# Altium schematic sheet INT_CONN.SchDoc
size A3; ApprovedBy: D. Grossman; CheckedBy: G. Engel; Author: Y. Yakov; CompanyName: LightSense; DrawnBy: Y. Yakov; Engineer: Y.Yakov; Organization: LightSense
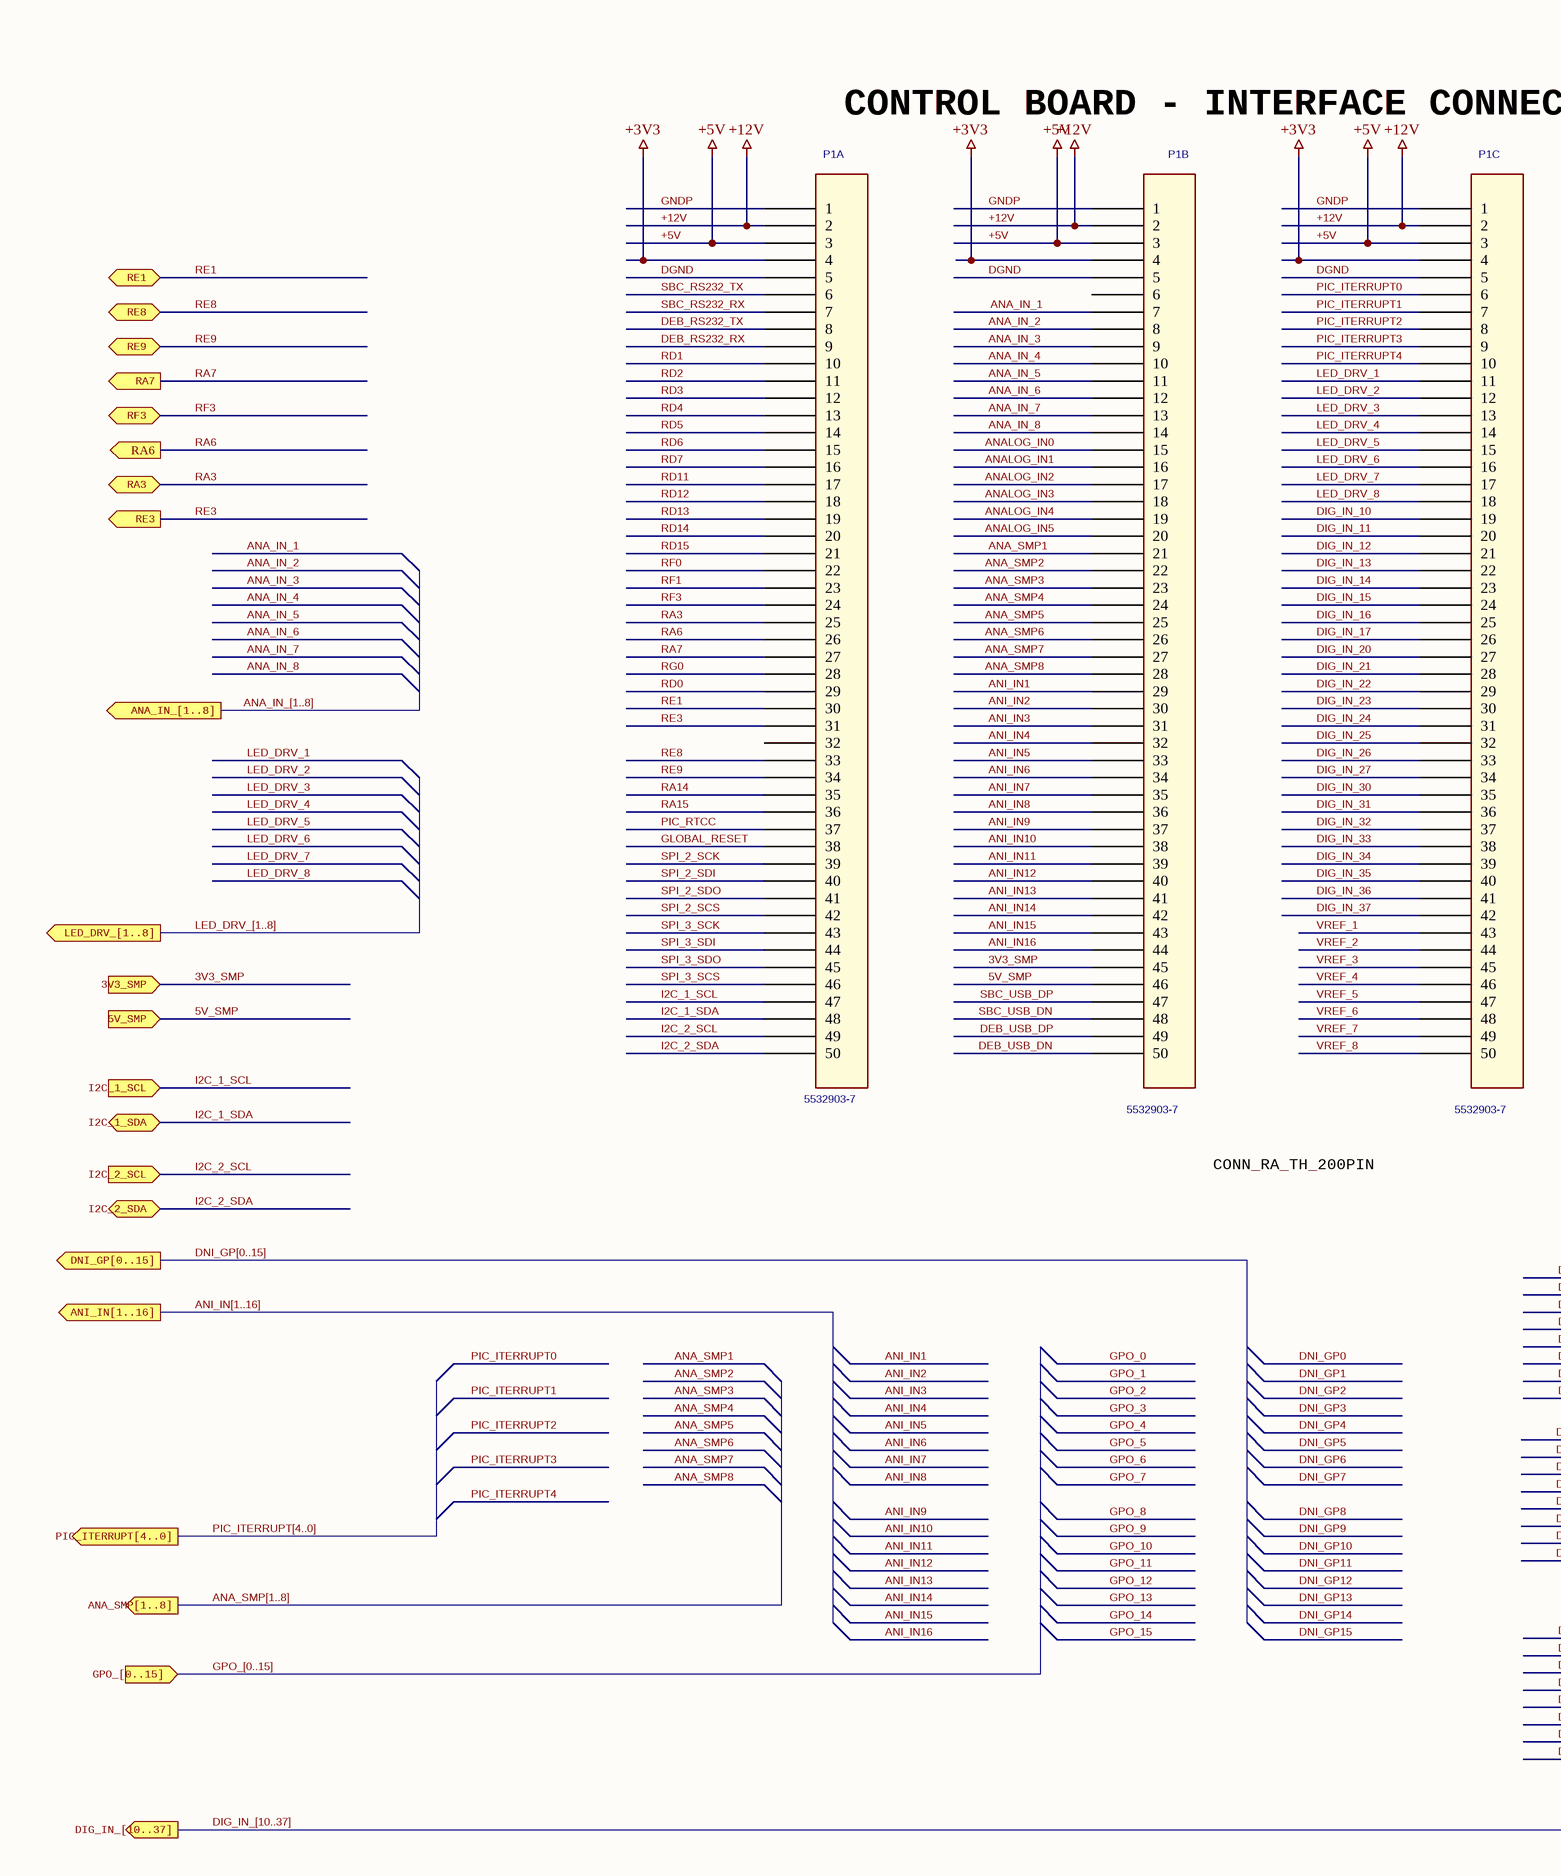
[diagram p0: INT_CONN.SchDoc, left]
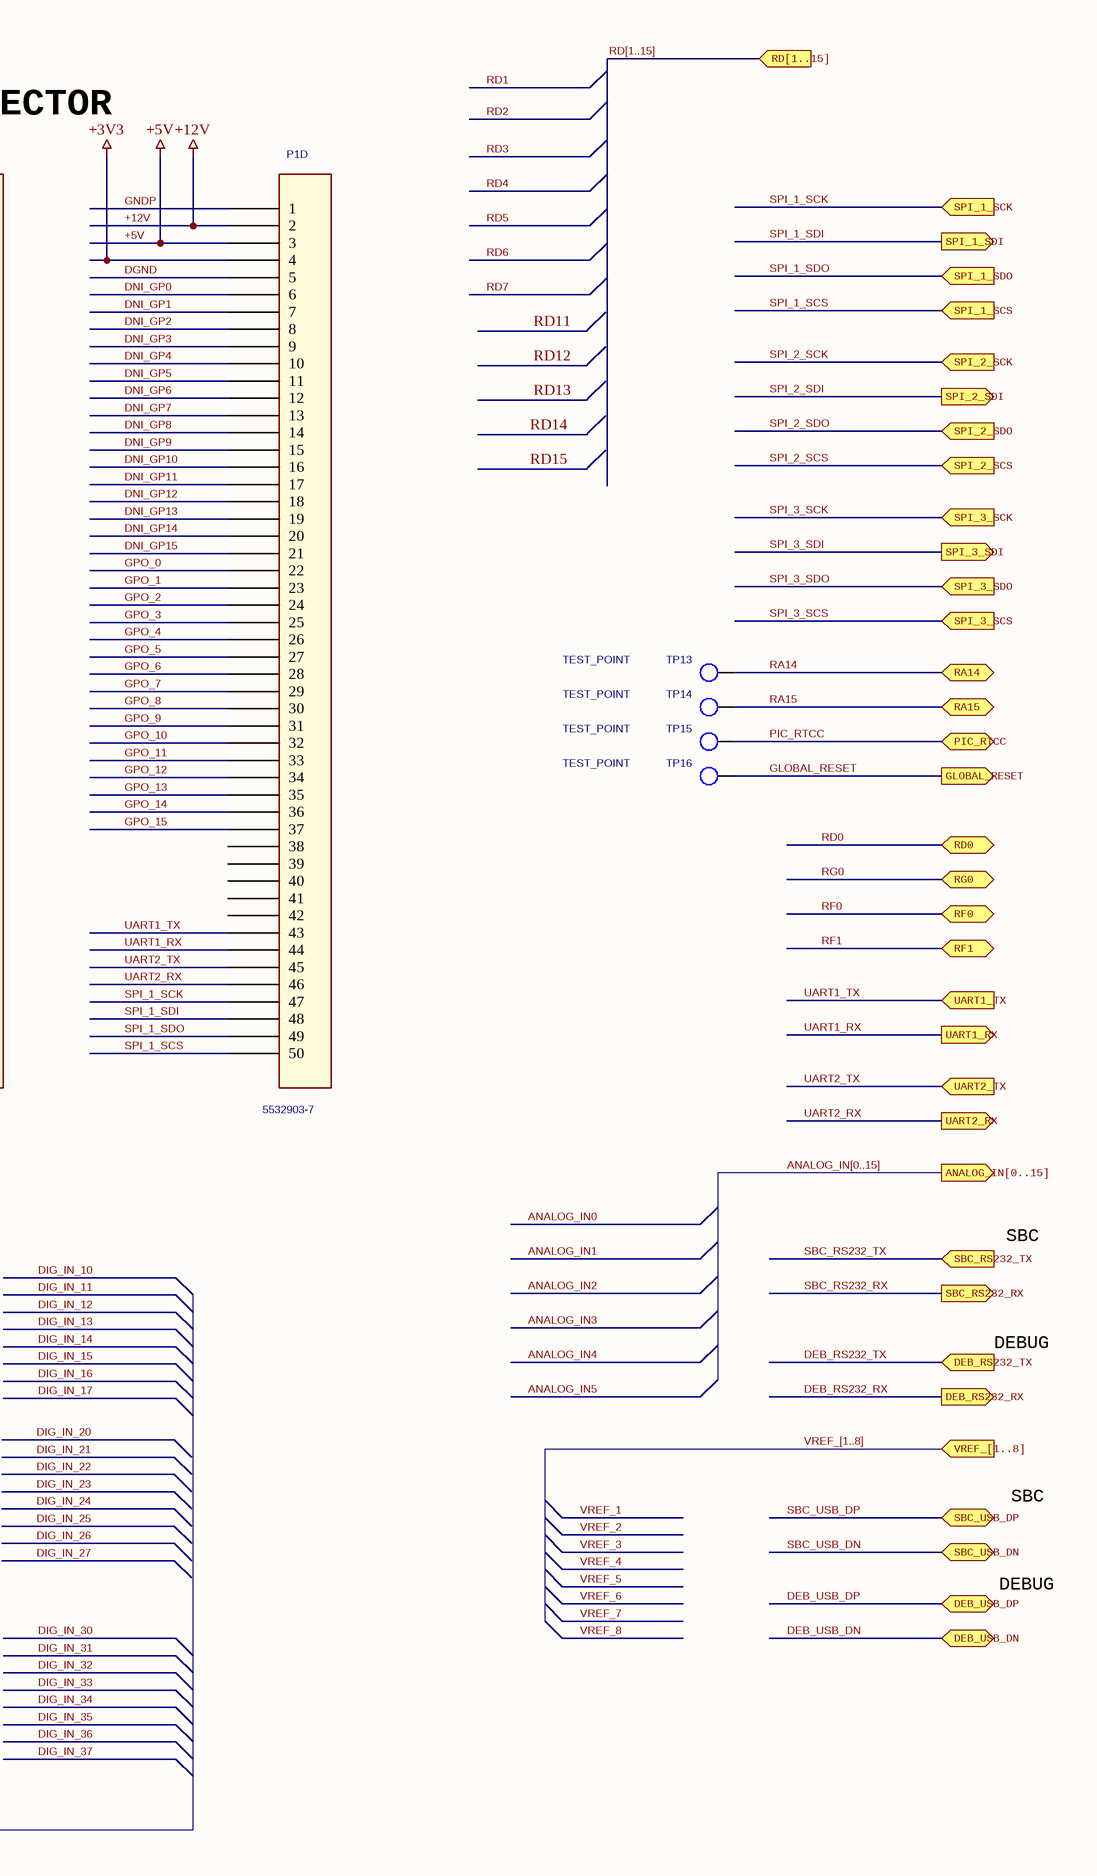
[diagram p1: INT_CONN.SchDoc, right]

## Parts
P1  5532903-7  [TH_4X50_100mil]  (parts A,B,C,D of 4)
TP13  TEST_POINT  [TH_1mm]
TP14  TEST_POINT  [TH_1mm]
TP15  TEST_POINT  [TH_1mm]
TP16  TEST_POINT  [TH_1mm]

## Ports
3V3_SMP (in), 5V_SMP (in), ANA_IN_[1..8] (out), ANA_SMP[1..8] (out), ANALOG_IN[0..15] (out), ANI_IN[1..16] (out), DEB_RS232_RX (out), DEB_RS232_TX (in), DEB_USB_DN (bidir), DEB_USB_DP (bidir), DIG_IN_[10..37] (out), DNI_GP[0..15] (out), GLOBAL_RESET (out), GPO_[0..15] (in), I2C_1_SCL (in), I2C_1_SDA (bidir), I2C_2_SCL (in), I2C_2_SDA (bidir), LED_DRV_[1..8] (out), PIC_ITERRUPT[4..0] (out), PIC_RTCC (bidir), RA3 (bidir), RA6 (out), RA7 (out), RA14 (bidir), RA15 (bidir), RD0 (bidir), RD[1..15] (in), RE1 (bidir), RE3 (out), RE8 (bidir), RE9 (bidir), RF0 (bidir), RF1 (bidir), RF3 (bidir), RG0 (bidir), SBC_RS232_RX (out), SBC_RS232_TX (in), SBC_USB_DN (bidir), SBC_USB_DP (bidir), SPI_1_SCK (in), SPI_1_SCS (in), SPI_1_SDI (out), SPI_1_SDO (in), SPI_2_SCK (in), SPI_2_SCS (in), SPI_2_SDI (out), SPI_2_SDO (in), SPI_3_SCK (in), SPI_3_SCS (in), SPI_3_SDI (out), SPI_3_SDO (in), UART1_RX (out), UART1_TX (in), UART2_RX (out), UART2_TX (in), VREF_[1..8] (in)

## Nets
+3V3: P1.4A(4) P1.4B(4) P1.4C(4) P1.4D(4)
+5V: P1.3A(3) P1.3B(3) P1.3C(3) P1.3D(3)
+12V: P1.2A(2) P1.2B(2) P1.2C(2) P1.2D(2)
3V3_SMP: P1.45B(45) ; port 3V3_SMP
5V_SMP: P1.46B(46) ; port 5V_SMP
ANA_IN_1: P1.7B(7)
ANA_IN_2: P1.8B(8)
ANA_IN_3: P1.9B(9)
ANA_IN_4: P1.10B(10)
ANA_IN_5: P1.11B(11)
ANA_IN_6: P1.12B(12)
ANA_IN_7: P1.13B(13)
ANA_IN_8: P1.14B(14)
ANA_SMP1: P1.21B(21)
ANA_SMP2: P1.22B(22)
ANA_SMP3: P1.23B(23)
ANA_SMP4: P1.24B(24)
ANA_SMP5: P1.25B(25)
ANA_SMP6: P1.26B(26)
ANA_SMP7: P1.27B(27)
ANA_SMP8: P1.28B(28)
ANALOG_IN0: P1.15B(15)
ANALOG_IN1: P1.16B(16)
ANALOG_IN2: P1.17B(17)
ANALOG_IN3: P1.18B(18)
ANALOG_IN4: P1.19B(19)
ANALOG_IN5: P1.20B(20)
ANI_IN1: P1.29B(29)
ANI_IN2: P1.30B(30)
ANI_IN3: P1.31B(31)
ANI_IN4: P1.32B(32)
ANI_IN5: P1.33B(33)
ANI_IN6: P1.34B(34)
ANI_IN7: P1.35B(35)
ANI_IN8: P1.36B(36)
ANI_IN9: P1.37B(37)
ANI_IN10: P1.38B(38)
ANI_IN11: P1.39B(39)
ANI_IN12: P1.40B(40)
ANI_IN13: P1.41B(41)
ANI_IN14: P1.42B(42)
ANI_IN15: P1.43B(43)
ANI_IN16: P1.44B(44)
DEB_RS232_RX: P1.9A(9) ; port DEB_RS232_RX
DEB_RS232_TX: P1.8A(8) ; port DEB_RS232_TX
DEB_USB_DN: P1.50B(50) ; port DEB_USB_DN
DEB_USB_DP: P1.49B(49) ; port DEB_USB_DP
DGND: P1.5A(5) P1.5B(5) P1.5C(5) P1.5D(5)
DIG_IN_10: P1.19C(19)
DIG_IN_11: P1.20C(20)
DIG_IN_12: P1.21C(21)
DIG_IN_13: P1.22C(22)
DIG_IN_14: P1.23C(23)
DIG_IN_15: P1.24C(24)
DIG_IN_16: P1.25C(25)
DIG_IN_17: P1.26C(26)
DIG_IN_20: P1.27C(27)
DIG_IN_21: P1.28C(28)
DIG_IN_22: P1.29C(29)
DIG_IN_23: P1.30C(30)
DIG_IN_24: P1.31C(31)
DIG_IN_25: P1.32C(32)
DIG_IN_26: P1.33C(33)
DIG_IN_27: P1.34C(34)
DIG_IN_30: P1.35C(35)
DIG_IN_31: P1.36C(36)
DIG_IN_32: P1.37C(37)
DIG_IN_33: P1.38C(38)
DIG_IN_34: P1.39C(39)
DIG_IN_35: P1.40C(40)
DIG_IN_36: P1.41C(41)
DIG_IN_37: P1.42C(42)
DNI_GP0: P1.6D(6)
DNI_GP1: P1.7D(7)
DNI_GP2: P1.8D(8)
DNI_GP3: P1.9D(9)
DNI_GP4: P1.10D(10)
DNI_GP5: P1.11D(11)
DNI_GP6: P1.12D(12)
DNI_GP7: P1.13D(13)
DNI_GP8: P1.14D(14)
DNI_GP9: P1.15D(15)
DNI_GP10: P1.16D(16)
DNI_GP11: P1.17D(17)
DNI_GP12: P1.18D(18)
DNI_GP13: P1.19D(19)
DNI_GP14: P1.20D(20)
DNI_GP15: P1.21D(21)
GLOBAL_RESET: P1.38A(38) TP16.1(TP) ; port GLOBAL_RESET
GNDP: P1.1A(1) P1.1B(1) P1.1C(1) P1.1D(1)
GPO_0: P1.22D(22)
GPO_1: P1.23D(23)
GPO_2: P1.24D(24)
GPO_3: P1.25D(25)
GPO_4: P1.26D(26)
GPO_5: P1.27D(27)
GPO_6: P1.28D(28)
GPO_7: P1.29D(29)
GPO_8: P1.30D(30)
GPO_9: P1.31D(31)
GPO_10: P1.32D(32)
GPO_11: P1.33D(33)
GPO_12: P1.34D(34)
GPO_13: P1.35D(35)
GPO_14: P1.36D(36)
GPO_15: P1.37D(37)
I2C_1_SCL: P1.47A(47) ; port I2C_1_SCL
I2C_1_SDA: P1.48A(48) ; port I2C_1_SDA
I2C_2_SCL: P1.49A(49) ; port I2C_2_SCL
I2C_2_SDA: P1.50A(50) ; port I2C_2_SDA
LED_DRV_1: P1.11C(11)
LED_DRV_2: P1.12C(12)
LED_DRV_3: P1.13C(13)
LED_DRV_4: P1.14C(14)
LED_DRV_5: P1.15C(15)
LED_DRV_6: P1.16C(16)
LED_DRV_7: P1.17C(17)
LED_DRV_8: P1.18C(18)
PIC_ITERRUPT0: P1.6C(6)
PIC_ITERRUPT1: P1.7C(7)
PIC_ITERRUPT2: P1.8C(8)
PIC_ITERRUPT3: P1.9C(9)
PIC_ITERRUPT4: P1.10C(10)
PIC_RTCC: P1.37A(37) TP15.1(TP) ; port PIC_RTCC
RA3: P1.25A(25) ; port RA3
RA6: P1.26A(26) ; port RA6
RA7: P1.27A(27) ; port RA7
RA14: P1.35A(35) TP13.1(TP) ; port RA14
RA15: P1.36A(36) TP14.1(TP) ; port RA15
RD0: P1.29A(29) ; port RD0
RD1: P1.10A(10)
RD2: P1.11A(11)
RD3: P1.12A(12)
RD4: P1.13A(13)
RD5: P1.14A(14)
RD6: P1.15A(15)
RD7: P1.16A(16)
RD11: P1.17A(17)
RD12: P1.18A(18)
RD13: P1.19A(19)
RD14: P1.20A(20)
RD15: P1.21A(21)
RE1: P1.30A(30) ; port RE1
RE3: P1.31A(31) ; port RE3
RE8: P1.33A(33) ; port RE8
RE9: P1.34A(34) ; port RE9
RF0: P1.22A(22) ; port RF0
RF1: P1.23A(23) ; port RF1
RF3: P1.24A(24) ; port RF3
RG0: P1.28A(28) ; port RG0
SBC_RS232_RX: P1.7A(7) ; port SBC_RS232_RX
SBC_RS232_TX: P1.6A(6) ; port SBC_RS232_TX
SBC_USB_DN: P1.48B(48) ; port SBC_USB_DN
SBC_USB_DP: P1.47B(47) ; port SBC_USB_DP
SPI_1_SCK: P1.47D(47) ; port SPI_1_SCK
SPI_1_SCS: P1.50D(50) ; port SPI_1_SCS
SPI_1_SDI: P1.48D(48) ; port SPI_1_SDI
SPI_1_SDO: P1.49D(49) ; port SPI_1_SDO
SPI_2_SCK: P1.39A(39) ; port SPI_2_SCK
SPI_2_SCS: P1.42A(42) ; port SPI_2_SCS
SPI_2_SDI: P1.40A(40) ; port SPI_2_SDI
SPI_2_SDO: P1.41A(41) ; port SPI_2_SDO
SPI_3_SCK: P1.43A(43) ; port SPI_3_SCK
SPI_3_SCS: P1.46A(46) ; port SPI_3_SCS
SPI_3_SDI: P1.44A(44) ; port SPI_3_SDI
SPI_3_SDO: P1.45A(45) ; port SPI_3_SDO
UART1_RX: P1.44D(44) ; port UART1_RX
UART1_TX: P1.43D(43) ; port UART1_TX
UART2_RX: P1.46D(46) ; port UART2_RX
UART2_TX: P1.45D(45) ; port UART2_TX
VREF_1: P1.43C(43)
VREF_2: P1.44C(44)
VREF_3: P1.45C(45)
VREF_4: P1.46C(46)
VREF_5: P1.47C(47)
VREF_6: P1.48C(48)
VREF_7: P1.49C(49)
VREF_8: P1.50C(50)

Not connected (* = marked no-connect by the designer): P1 6B(6) 32A(32) 38D(38) 39D(39) 40D(40) 41D(41) 42D(42)

## Buses and harness runs
bus ANA_IN_[1..8] = port ANA_IN_[1..8]
bus ANA_SMP[1..8] = port ANA_SMP[1..8]
bus ANALOG_IN[0..15] = port ANALOG_IN[0..15]
bus ANI_IN[1..16] = port ANI_IN[1..16]
bus DIG_IN_[10..37] = port DIG_IN_[10..37]
bus DNI_GP[0..15] = port DNI_GP[0..15]
bus GPO_[0..15] = port GPO_[0..15]
bus LED_DRV_[1..8] = port LED_DRV_[1..8]
bus PIC_ITERRUPT[4..0] = port PIC_ITERRUPT[4..0]
bus RD[1..15] = port RD[1..15]
bus VREF_[1..8] = port VREF_[1..8]

## Notes on the sheet
- CONTROL BOARD - INTERFACE CONNECTOR
- CONN_RA_TH_200PIN
- SBC
- DEBUG
- Name
- Signature
- Date
- File:
- Board Name:
- Description:
- Document Version:
- Sheet
- of
- Approved
- Reviewed
- Designed
- This drawing and any accompanying documents contain confidential information intended for a specific individual and purpose.
  This information, owned by Lightsense, is private and confidential. If you are not the intended recipient, you are hereby notified that any disclosure, copying or distribution, or the taking of any action based on the contents of this information, is strictly prohibited.

## Library data of the parts
P1 = CONN_RA_TH_200PIN: System: Connector
TP13-TP16 = T POINT R_Dup1